# Altium project sensorMesh_nano.PrjPCB
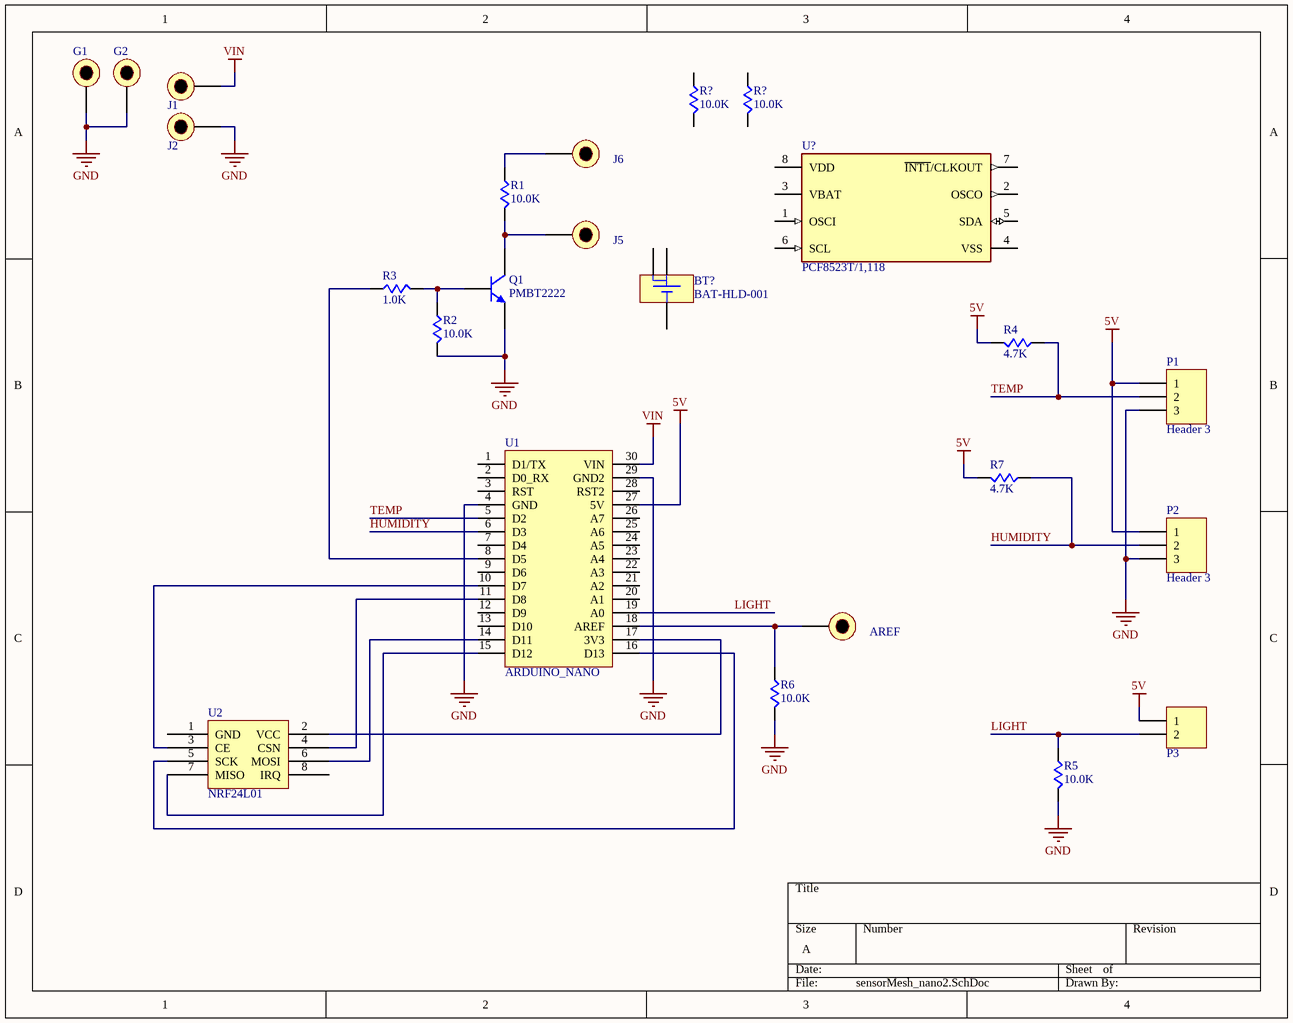
[diagram p0: sensorMesh_nano2.SchDoc]
1 sheet, 24 parts. Net scope: global (net labels, ports and power ports of the same name join across sheets).
Board file: sensorMesh_nano.PcbDoc

## Sheet sensorMesh_nano2.SchDoc
size A

### Parts
(Parts that share a designator on the sheet are numbered #1, #2 ... from top to bottom, then left to right.)
AREF  WIRE_HOLE  [20awg-wire]  (value not drawn)
BT?  BAT-HLD-001  [BATHLD-001]
G1  WIRE_HOLE  [20awg-wire]  (value not drawn)
G2  WIRE_HOLE  [20awg-wire]  (value not drawn)
J1  WIRE_HOLE  [18awg-wire]  (value not drawn)
J2  WIRE_HOLE  [18awg-wire]  (value not drawn)
J5  WIRE_HOLE  [20awg-wire]  (value not drawn)
J6  WIRE_HOLE  [20awg-wire]  (value not drawn)
P1  Header 3  [HDR1X3]
P2  Header 3  [HDR1X3]
P3  Header 2  [HDR1X2]  (value not drawn)
Q1  PMBT2222  [SOT23_N]
R1  value 10.0K  [RESC1005N]  (hidden comment: R)
R2  value 10.0K  [RESC1005N]  (hidden comment: R)
R3  value 1.0K  [RESC1005N]  (hidden comment: R)
R4  value 4.7K  [RESC1005N]  (hidden comment: R)
R5  value 10.0K  [RESC1005N]  (hidden comment: R)
R6  value 10.0K  [RESC1005N]  (hidden comment: R)
R7  value 4.7K  [RESC1005N]  (hidden comment: R)
R?#1  value 10.0K  [RESC1005N]  (hidden comment: R)
R?#2  value 10.0K  [RESC1005N]  (hidden comment: R)
U1  ARDUINO_NANO  [ARDUINO_NANO]
U2  NRF24L01  [NRF24L01]
U?  PCF8523T/1,118  [FP-SOT96-1-IPC_B]

### Nets
5V: P1.1 P2.1 P3.1 R4.2 R7.2 U1.27(5V)
GND: G1.1 G2.1 J2.1 P1.3 P2.3 Q1.2(E) R2.2 R5.2 R6.2 U1.4(GND) U1.29(GND2)
VIN: J1.1 U1.30(VIN)
HUMIDITY: P2.2 R7.1 U1.6(D3)
LIGHT: P3.2 R5.1 U1.19(A0)
TEMP: P1.2 R4.1 U1.5(D2)
NetAREF_1: AREF.1 R6.1 U1.18(AREF)
NetJ5_1: J5.1 Q1.3(C) R1.2
NetJ6_1: J6.1 R1.1
NetQ1_1: Q1.1(B) R2.1 R3.2
NetR3_1: R3.1 U1.8(D5)
NetU1_10: U1.10(D7) U2.3(CE)
NetU1_11: U1.11(D8) U2.4(CSN)
NetU1_14: U1.14(D11) U2.6(MOSI)
NetU1_15: U1.15(D12) U2.7(MISO)
NetU1_16: U1.16(D13) U2.5(SCK)
NetU1_17: U1.17(3V3) U2.2(VCC)

Not connected (* = marked no-connect by the designer): BT? 1(-) 2(+) 3(+); R?#1 1 2; R?#2 1 2; U1 1(D1/TX) 2(D0_RX) 3(RST) 7(D4) 9(D6) 12(D9) 13(D10) 20(A1) 21(A2) 22(A3) 23(A4) 24(A5) 25(A6) 26(A7) 28(RST2); U2 1(GND) 8(IRQ); U? 1(OSCI) 2(OSCO) 3(VBAT) 4(VSS) 5(SDA) 6(SCL) 7(~{INT1}/CLKOUT) 8(VDD)

### Library data of the parts
BT? = CMP-0168-00043-1: 20mm Coin Cell Battery Holder; PCB_Layout: Complies with manufacturer's recommendation.; DatasheetVersion: rev1.0, Dec-2007; PackageVersion: rev1.0, Dec-2007; PackageReference: BATHLD-001; PackageDescription: Low Profile SM Battery Holder, 20mm Lithium Cell, 21.1 x 15.3 x 4.2 mm Body
P1 P2 = Header 3: Header, 3-Pin; LatestRevisionDate: 17-Jul-2002; LatestRevisionNote: Re-released for DXP Platform.; Publisher: Altium Limited
P3 = Header 2: CONN HEADER 2POS .100" STR GOLD; Manufacturer Part Number 1: 0901200762; Manufacturer 1: Molex Inc; Substitution Allowed ?: Yes; Supplier 1: Digi-Key; Supplier 1 Part Number: WM8084-ND; Description 1: CONN HEADER 2POS .100" STR GOLD
Q1 = NPN: NPN Switching Transistor; Manufacturer 1: *; Manufacturer Part Number 1: *; Value: PMBT2222; Supplier 1: Digi-Key; Supplier Part Number 1: 1727-2956-1-ND
R1-R7 R?#1 R?#2 = R: Resistor; Manufacturer 1: *; Manufacturer Part Number 1: *; Supplier 1: Digi-Key
  R1 R2 R5 R6 R?#1 R?#2: Supplier Part Number 1: P10.0KHTR-ND
  R3: Supplier Part Number 1: P1.00KHCT-ND
  R4 R7: Supplier Part Number 1: P4.70KHCT-ND
U1 = Arduino_Nano: ARDUINO NANO MODULE
U? = CMP-10083-000014-1: IC RTC CLK/CALENDAR I2C 8-SOIC; Time Format: HH:MM:SS; Min Supply Voltage: 1.2V; Max Supply Voltage: 5.5V; Logic Function: Clock; Min Operating Temperature: -40°C; Case/Package: SO; Radiation Hardening: No; Interface: I2C; Max Operating Temperature: 85°C; Contact Plating: Gold; Packaging: Tape and Reel; Package Quantity: 2500; Lead Free: Lead Free; Number of Pins: 8; Mount: Surface Mount; REACH SVHC: No SVHC